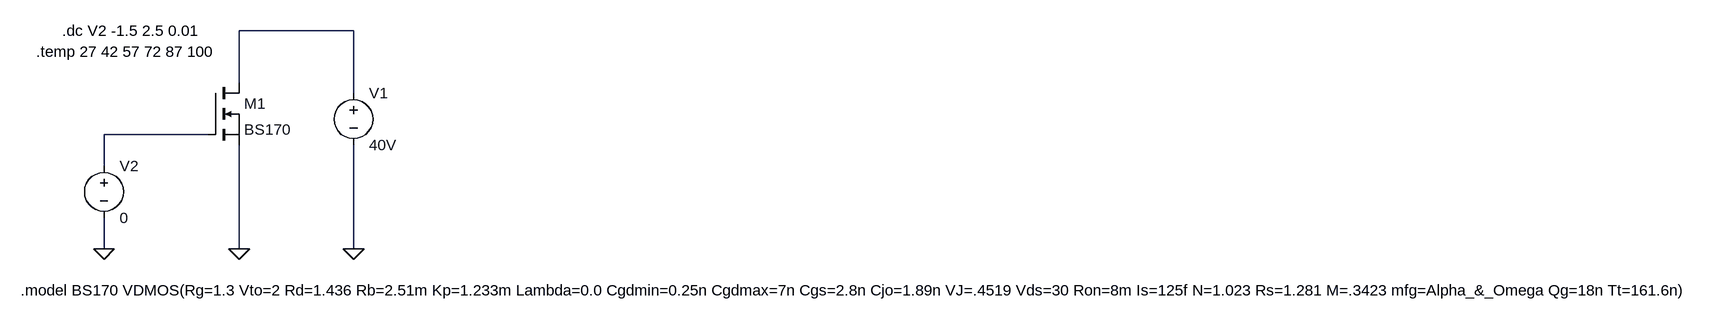
[diagram p0: schematic TPMOS1A.asc]
TPMOS1A.asc, the LTspice schematic file:
Version 4
SHEET 1 2388 680
WIRE 80 96 -96 96
WIRE -96 176 -96 96
WIRE 80 192 80 96
WIRE -144 256 -304 256
WIRE -304 304 -304 256
WIRE -304 432 -304 384
WIRE -96 432 -96 272
WIRE 80 432 80 272
FLAG -304 432 0
FLAG -96 432 0
FLAG 80 432 0
SYMBOL voltage -304 288 R0
WINDOW 123 0 0 Left 0
WINDOW 39 0 0 Left 0
SYMATTR InstName V2
SYMATTR Value 0
SYMBOL nmos -144 176 R0
SYMATTR InstName M1
SYMATTR Value BS170
SYMBOL voltage 80 176 R0
SYMATTR InstName V1
SYMATTR Value 40V
TEXT -432 496 Left 2 !.model BS170 VDMOS(Rg=1.3 Vto=2 Rd=1.436 Rb=2.51m Kp=1.233m Lambda=0.0 Cgdmin=0.25n Cgdmax=7n Cgs=2.8n Cjo=1.89n VJ=.4519 Vds=30 Ron=8m Is=125f N=1.023 Rs=1.281 M=.3423 mfg=Alpha_&_Omega Qg=18n Tt=161.6n)
TEXT -368 96 Left 2 !.dc V2 -1.5 2.5 0.01
TEXT -408 128 Left 2 !.temp 27 42 57 72 87 100

The netlist it stands for:
* TPMOS1A.asc
V2 N002 0 0
M1 N001 N002 0 0 BS170
V1 N001 0 40V
.model NMOS NMOS
.model PMOS PMOS
.lib standard.mos
.model BS170 VDMOS(Rg=1.3 Vto=2 Rd=1.436 Rb=2.51m Kp=1.233m Lambda=0.0 Cgdmin=0.25n Cgdmax=7n Cgs=2.8n Cjo=1.89n VJ=.4519 Vds=30 Ron=8m Is=125f N=1.023 Rs=1.281 M=.3423 mfg=Alpha_&_Omega Qg=18n Tt=161.6n)
.dc V2 -1.5 2.5 0.01
.temp 27 42 57 72 87 100
.backanno
.end